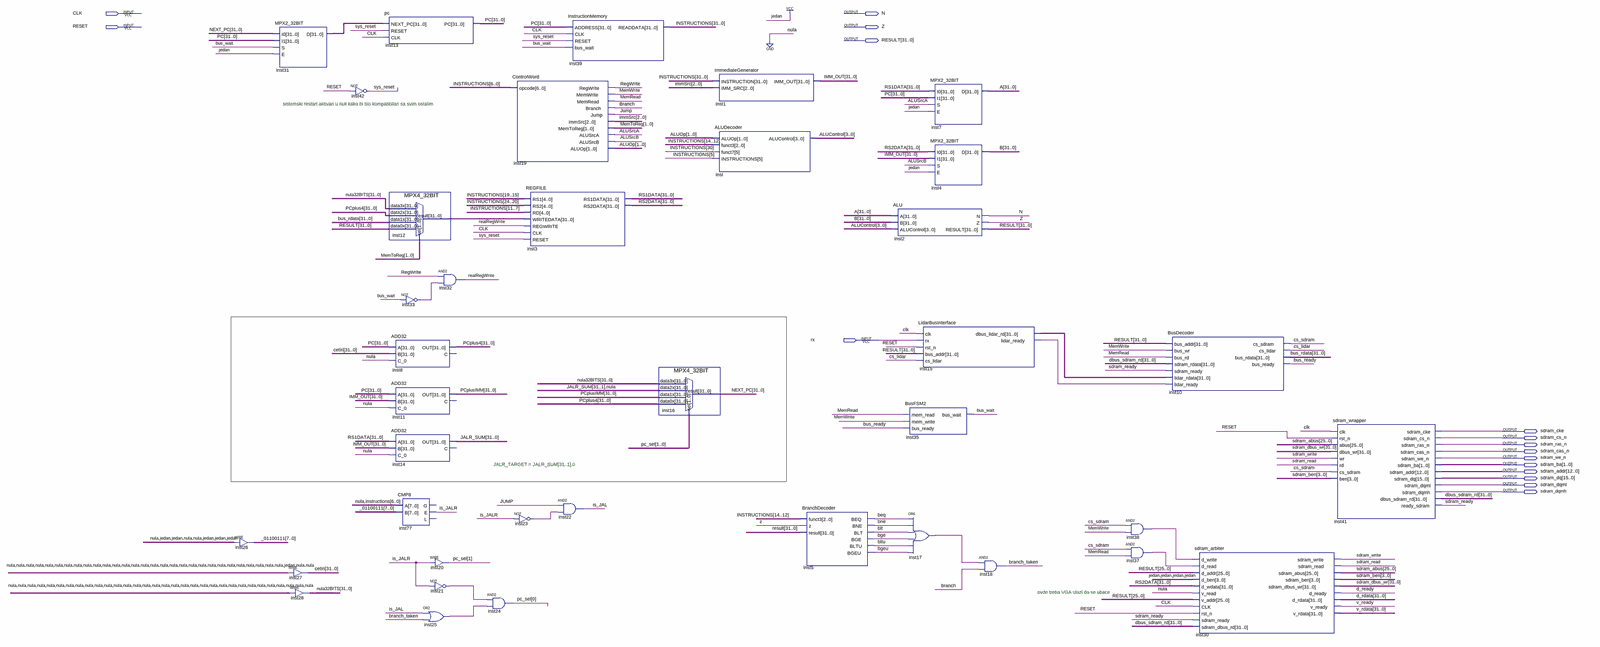
[diagram p0: schematic sheet, whole]
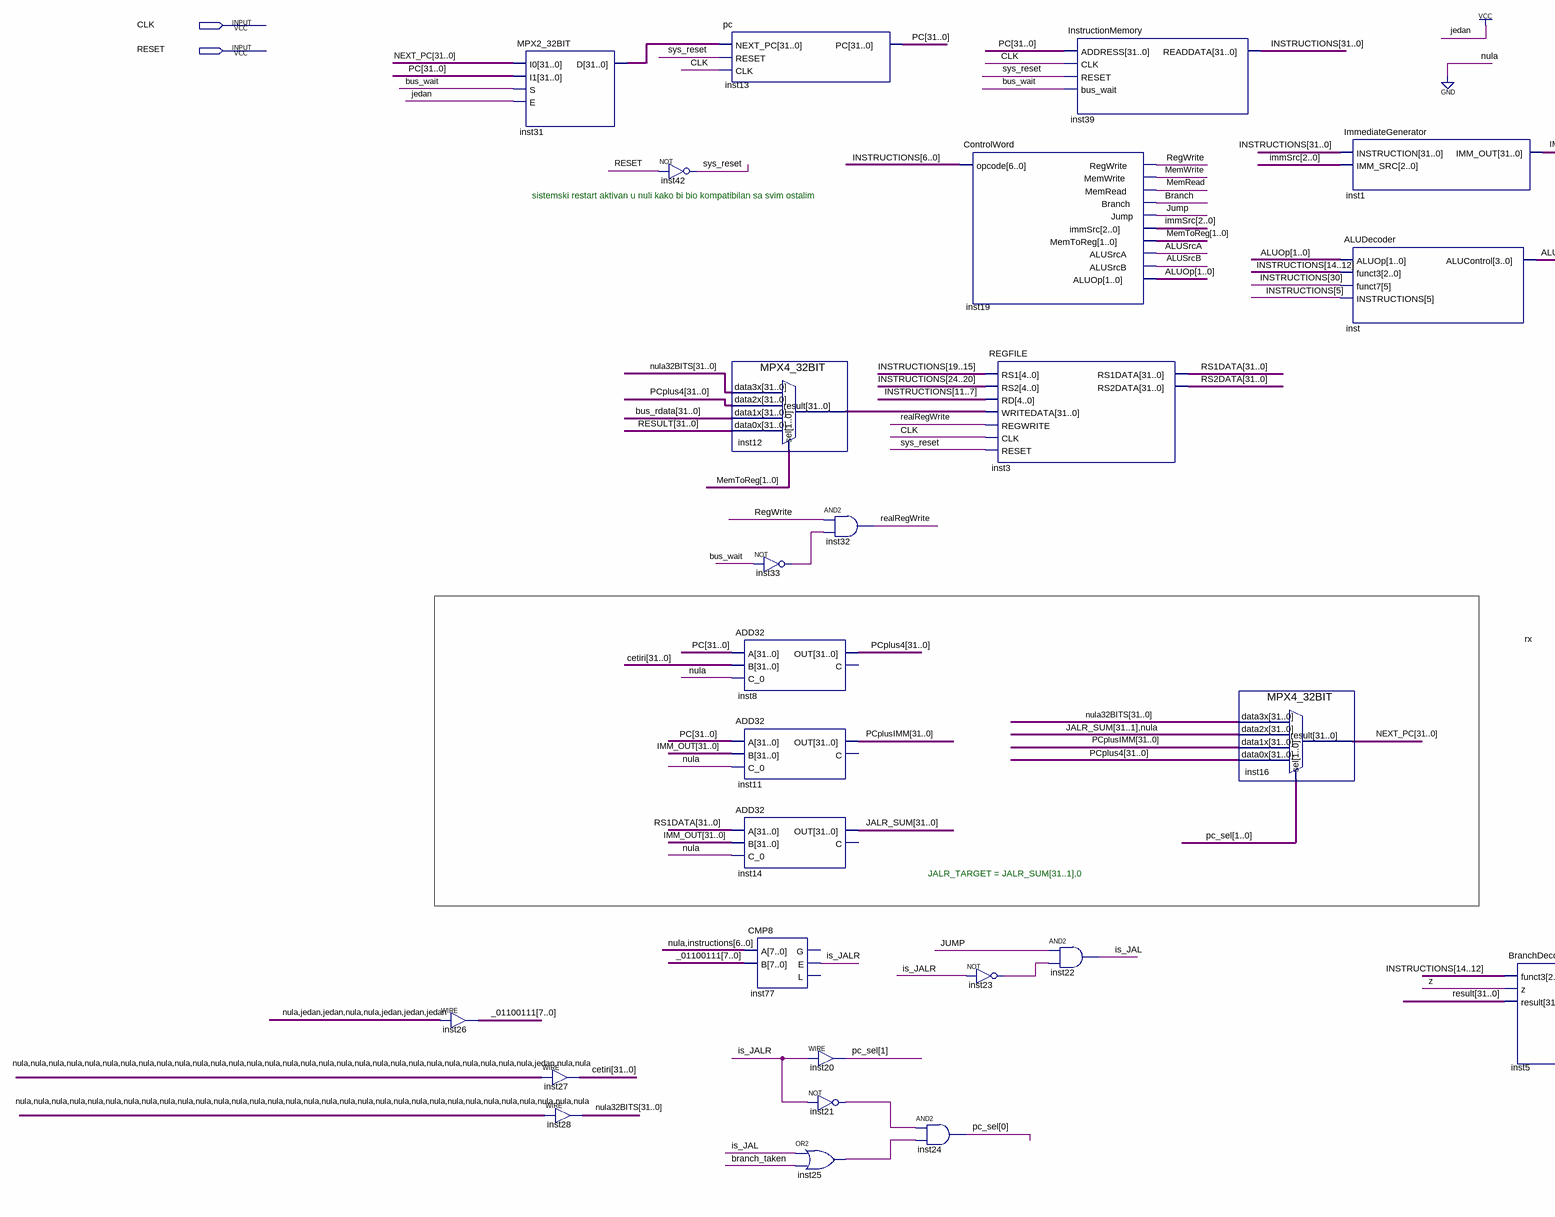
[diagram p1: schematic sheet, left part]
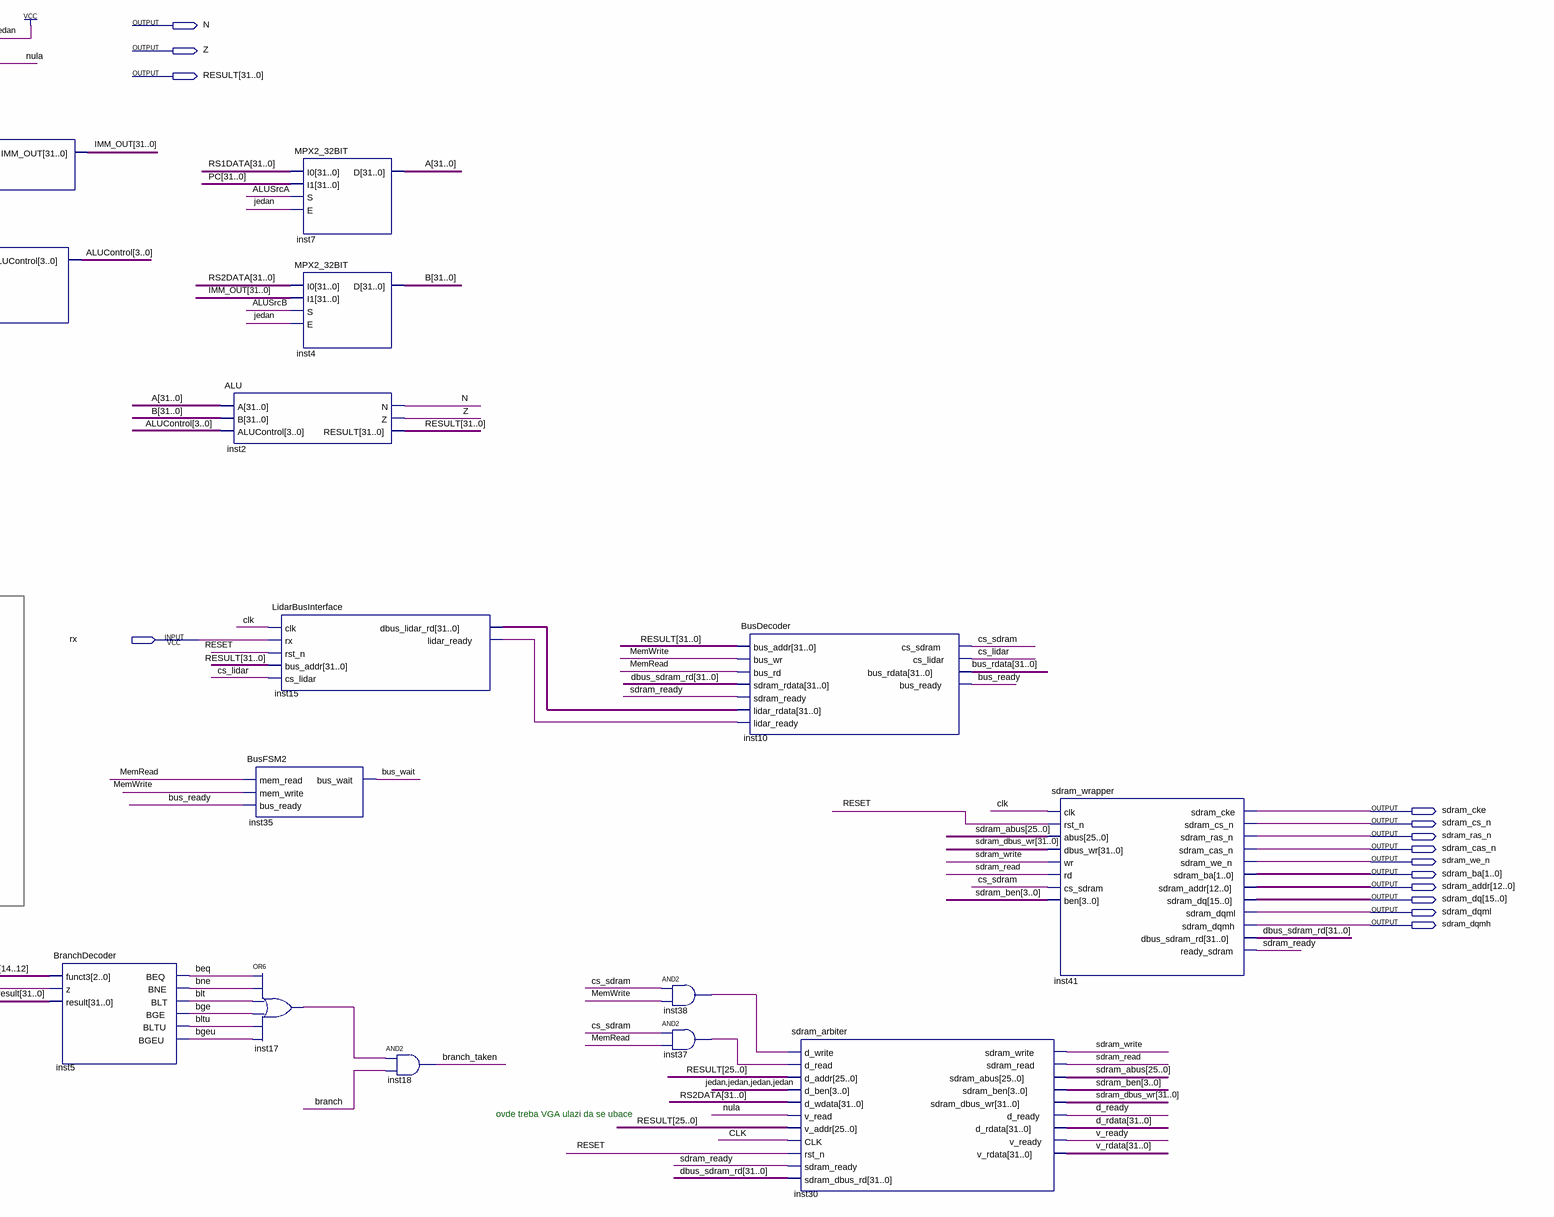
[diagram p2: schematic sheet, right part]
// Quartus schematic riscv32i_3.bdf as structural Verilog: 38 symbols, 16 pins
module riscv32i_3 (
  input  CLK,
  input  RESET,
  input  rx,
  output N,
  output Z,
  output [31:0] RESULT,
  output sdram_cke,
  output sdram_cs_n,
  output sdram_ras_n,
  output sdram_cas_n,
  output sdram_we_n,
  output [1:0] sdram_ba,
  output [12:0] sdram_addr,
  output [15:0] sdram_dq,
  output sdram_dqml,
  output sdram_dqmh
);

  wire ALUSrcA, ALUSrcB, beq, bge, bgeu, blt, bltu, bne, Branch, branch_taken, bus_ready, bus_wait, cs_lidar,
       cs_sdram, d_ready, inst15_lidar_ready, inst17_out, inst21_out, inst23_out, inst25_out, inst33_out,
       inst37_out, inst38_out, is_JAL, is_JALR, JUMP, MemRead, MemWrite, realRegWrite, RegWrite, sdram_read,
       sdram_ready, sdram_write, sys_reset, v_ready;
  wire [1:0] ALUOp, MemToReg, pc_sel;
  wire [2:0] immSrc;
  wire [3:0] ALUControl, sdram_ben;
  wire [7:0] _01100111;
  wire [25:0] sdram_abus;
  wire [31:0] A, B, bus_rdata, cetiri, d_rdata, dbus_sdram_rd, IMM_OUT, inst12_result, inst15_dbus_lidar_rd,
       inst31_d, INSTRUCTIONS, JALR_SUM, NEXT_PC, nula32BITS, PC, PCplus4, PCplusIMM, RS1DATA, RS2DATA,
       sdram_dbus_wr, v_rdata;

  assign _01100111 = 8'b01100111;  // WIRE inst26
  MPX2_32BIT inst31 (.I0(NEXT_PC), .I1(PC), .S(bus_wait), .E(1'b1), .D(inst31_d));
  assign cetiri = 32'b00000000000000000000000000000100;  // WIRE inst27
  assign nula32BITS = {32{1'b0}};  // WIRE inst28
  not inst42 (sys_reset, RESET);
  pc inst13 (.NEXT_PC(inst31_d), .RESET(sys_reset), .CLK(CLK), .PC(PC));
  MPX4_32BIT inst12 (
    .data3x(nula32BITS), .data2x(PCplus4), .data1x(bus_rdata), .data0x(RESULT), .sel(MemToReg),
    .result(inst12_result));
  not inst33 (inst33_out, bus_wait);
  ADD32 inst8 (.A(PC), .B(cetiri), .C_0(1'b0), .OUT(PCplus4));  // open: C
  ADD32 inst11 (.A(PC), .B(IMM_OUT), .C_0(1'b0), .OUT(PCplusIMM));  // open: C
  ADD32 inst14 (.A(RS1DATA), .B(IMM_OUT), .C_0(1'b0), .OUT(JALR_SUM));  // open: C
  CMP8 inst77 (.A({1'b0, INSTRUCTIONS[6:0]}), .B(_01100111), .E(is_JALR));  // open: G, L
  assign pc_sel[1] = is_JALR;  // WIRE inst20
  not inst21 (inst21_out, is_JALR);
  or inst25 (inst25_out, is_JAL, branch_taken);
  and inst32 (realRegWrite, RegWrite, inst33_out);
  and inst24 (pc_sel[0], inst21_out, inst25_out);
  ControlWord inst19 (
    .opcode(INSTRUCTIONS[6:0]), .RegWrite(RegWrite), .MemWrite(MemWrite), .MemRead(MemRead), .Branch(Branch),
    .Jump(JUMP), .immSrc(immSrc), .MemToReg(MemToReg), .ALUSrcA(ALUSrcA), .ALUSrcB(ALUSrcB), .ALUOp(ALUOp));
  not inst23 (inst23_out, is_JALR);
  REGFILE inst3 (
    .RS1(INSTRUCTIONS[19:15]), .RS2(INSTRUCTIONS[24:20]), .RD(INSTRUCTIONS[11:7]), .WRITEDATA(inst12_result),
    .REGWRITE(realRegWrite), .CLK(CLK), .RESET(sys_reset), .RS1DATA(RS1DATA), .RS2DATA(RS2DATA));
  InstructionMemory inst39 (.ADDRESS(PC), .CLK(CLK), .RESET(sys_reset), .bus_wait(bus_wait), .READDATA(INSTRUCTIONS));
  and inst22 (is_JAL, JUMP, inst23_out);
  MPX4_32BIT inst16 (
    .data3x(nula32BITS), .data2x({JALR_SUM[31:1], 1'b0}), .data1x(PCplusIMM), .data0x(PCplus4), .sel(pc_sel),
    .result(NEXT_PC));
  ImmediateGenerator inst1 (.INSTRUCTION(INSTRUCTIONS), .IMM_SRC(immSrc), .IMM_OUT(IMM_OUT));
  ALUDecoder inst (
    .ALUOp(ALUOp), .funct3(INSTRUCTIONS[14:12]), .funct7(INSTRUCTIONS[30]), .INSTRUCTIONS(INSTRUCTIONS[5]),
    .ALUControl(ALUControl));
  BranchDecoder inst5 (
    .funct3(INSTRUCTIONS[14:12]), .z(Z), .result(RESULT), .BEQ(beq), .BNE(bne), .BLT(blt), .BGE(bge),
    .BLTU(bltu), .BGEU(bgeu));
  ALU inst2 (.A(A), .B(B), .ALUControl(ALUControl), .N(N), .Z(Z), .RESULT(RESULT));
  LidarBusInterface inst15 (
    .clk(CLK), .rx(rx), .rst_n(RESET), .bus_addr(RESULT), .cs_lidar(cs_lidar),
    .dbus_lidar_rd(inst15_dbus_lidar_rd), .lidar_ready(inst15_lidar_ready));
  BusFSM2 inst35 (.mem_read(MemRead), .mem_write(MemWrite), .bus_ready(bus_ready), .bus_wait(bus_wait));
  or inst17 (inst17_out, beq, bne, blt, bge, bltu, bgeu);
  MPX2_32BIT inst7 (.I0(RS1DATA), .I1(PC), .S(ALUSrcA), .E(1'b1), .D(A));
  MPX2_32BIT inst4 (.I0(RS2DATA), .I1(IMM_OUT), .S(ALUSrcB), .E(1'b1), .D(B));
  and inst18 (branch_taken, inst17_out, Branch);
  and inst38 (inst38_out, cs_sdram, MemWrite);
  and inst37 (inst37_out, cs_sdram, MemRead);
  BusDecoder inst10 (
    .bus_addr(RESULT), .bus_wr(MemWrite), .bus_rd(MemRead), .sdram_rdata(dbus_sdram_rd),
    .sdram_ready(sdram_ready), .lidar_rdata(inst15_dbus_lidar_rd), .lidar_ready(inst15_lidar_ready),
    .cs_sdram(cs_sdram), .cs_lidar(cs_lidar), .bus_rdata(bus_rdata), .bus_ready(bus_ready));
  sdram_arbiter inst30 (
    .d_write(inst38_out), .d_read(inst37_out), .d_addr(RESULT[25:0]), .d_ben(4'b1111), .d_wdata(RS2DATA),
    .v_read(1'b0), .v_addr(RESULT[25:0]), .CLK(CLK), .rst_n(RESET), .sdram_ready(sdram_ready),
    .sdram_dbus_rd(dbus_sdram_rd), .sdram_write(sdram_write), .sdram_read(sdram_read),
    .sdram_abus(sdram_abus), .sdram_ben(sdram_ben), .sdram_dbus_wr(sdram_dbus_wr), .d_ready(d_ready),
    .d_rdata(d_rdata), .v_ready(v_ready), .v_rdata(v_rdata));
  sdram_wrapper inst41 (
    .clk(CLK), .rst_n(RESET), .abus(sdram_abus), .dbus_wr(sdram_dbus_wr), .wr(sdram_write), .rd(sdram_read),
    .cs_sdram(cs_sdram), .ben(sdram_ben), .sdram_cke(sdram_cke), .sdram_cs_n(sdram_cs_n),
    .sdram_ras_n(sdram_ras_n), .sdram_cas_n(sdram_cas_n), .sdram_we_n(sdram_we_n), .sdram_ba(sdram_ba),
    .sdram_addr(sdram_addr), .sdram_dqml(sdram_dqml), .sdram_dqmh(sdram_dqmh), .dbus_sdram_rd(dbus_sdram_rd),
    .ready_sdram(sdram_ready), .sdram_dq(sdram_dq));

  // Notes on the sheet:
  //   sistemski restart aktivan u nuli kako bi bio kompatibilan sa svim ostalim
  //   JALR_TARGET = JALR_SUM[31..1],0
  //   ovde treba VGA ulazi da se ubace
endmodule
